# Altium schematic sheet TMC2130.SchDoc
size A
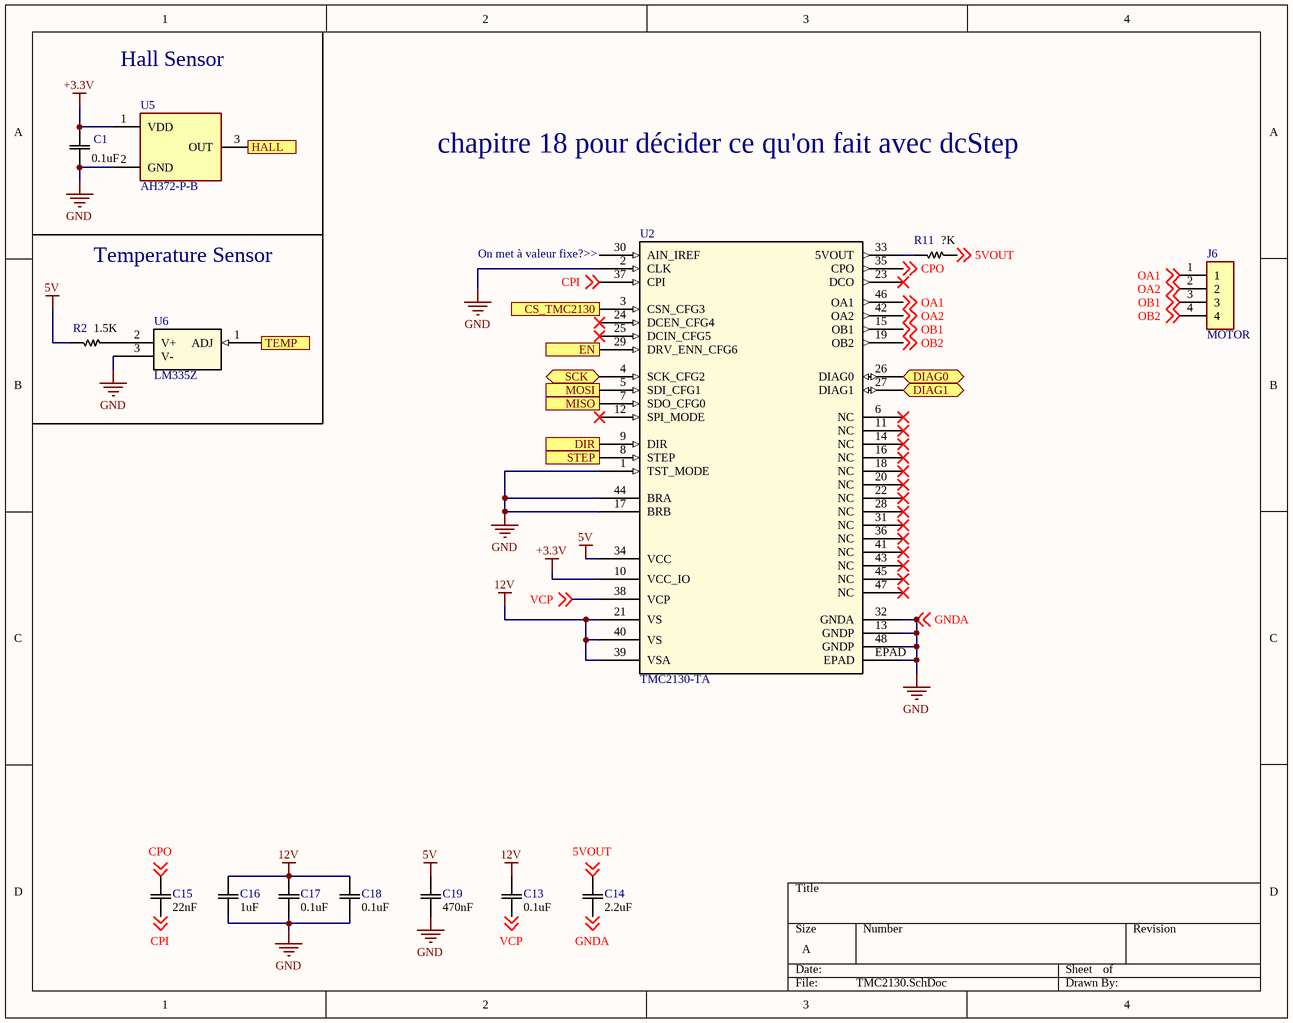
[diagram p0: TMC2130.SchDoc]

## Parts
C1  value 0.1uF  [0603]  (hidden comment: Capacitor 1206)
C13  value 0.1uF  [0603]  (hidden comment: Capacitor 1206)
C14  value 2.2uF  [0603]  (hidden comment: Capacitor 1206)
C15  value 22nF  [0603]  (hidden comment: Capacitor 1206)
C16  value 1uF  [0603]  (hidden comment: Capacitor 1206)
C17  value 0.1uF  [0603]  (hidden comment: Capacitor 1206)
C18  value 0.1uF  [0603]  (hidden comment: Capacitor 1206)
C19  value 470nF  [0603]  (hidden comment: Capacitor 1206)
J6  MOTOR  [JST 4POS 2.5mm 90°]
R2  value 1.5K  [0603]  (hidden comment: Resistor 1206)
R11  value ?K  [0603]  (hidden comment: Resistor 1206)
U2  TMC2130-TA  [eTQFP48_9x9]
U5  AH372-P-B  [AH372PB]
U6  LM335Z  [TO92]

## Ports
CS_TMC2130 (in), DIAG0 (bidir), DIAG1 (bidir), DIR (in), EN (in), HALL (out), MISO (out), MOSI (in), SCK (bidir), STEP (in), TEMP (out)

## Nets
5V: C19.2 R2.1 U2.34(VCC)
12V: C13.2 C16.2 C17.2 C18.2 U2.21(VS) U2.39(VSA) U2.40(VS)
+3.3V: C1.2 U2.10(VCC_IO) U5.1(VDD)
GND: C1.1 C14.1 C16.1 C17.1 C18.1 C19.1 U2.1(TST_MODE) U2.2(CLK) U2.13(GNDP) U2.17(BRB) U2.32(GNDA) U2.44(BRA) U2.48(GNDP) U2.EPAD U5.2(GND) U6.3(V-) ; off-sheet GNDA  [also labelled GNDA]
5VOUT: C14.2 R11.2 ; off-sheet 5VOUT
CPI: C15.1 U2.37(CPI) ; off-sheet CPI
CPO: C15.2 U2.35(CPO) ; off-sheet CPO
CS_TMC2130: U2.3(CSN_CFG3) ; port CS_TMC2130
DIAG0: U2.26(DIAG0) ; port DIAG0
DIAG1: U2.27(DIAG1) ; port DIAG1
DIR: U2.9(DIR) ; port DIR
EN: U2.29(DRV_ENN_CFG6) ; port EN
HALL: U5.3(OUT) ; port HALL
MISO: U2.7(SDO_CFG0) ; port MISO
MOSI: U2.5(SDI_CFG1) ; port MOSI
OA1: J6.1 U2.46(OA1) ; off-sheet OA1
OA2: J6.2 U2.42(OA2) ; off-sheet OA2
OB1: J6.3 U2.15(OB1) ; off-sheet OB1
OB2: J6.4 U2.19(OB2) ; off-sheet OB2
SCK: U2.4(SCK_CFG2) ; port SCK
STEP: U2.8(STEP) ; port STEP
TEMP: U6.1(ADJ) ; port TEMP
VCP: C13.1 U2.38(VCP) ; off-sheet VCP
NetR2_2: R2.2 U6.2(V+)
NetR11_1: R11.1 U2.33(5VOUT)

Not connected (* = marked no-connect by the designer): U2 6(NC)* 11(NC)* 12(SPI_MODE)* 14(NC)* 16(NC)* 18(NC)* 20(NC)* 22(NC)* 23(DCO)* 24(DCEN_CFG4)* 25(DCIN_CFG5)* 28(NC)* 30(AIN_IREF) 31(NC)* 36(NC)* 41(NC)* 43(NC)* 45(NC)* 47(NC)*

## Notes on the sheet
- Hall Sensor
- chapitre 18 pour décider ce qu'on fait avec dcStep
- Temperature Sensor
- (near U2) On met à valeur fixe?>>

## Library data of the parts
C1 C13-C19 = Capacitor 1206: Capacitor SMD 1206; Manufacturer_Part_Number: 12065A820JAT2A; Vendor: AVX Corporation; Built_By: EMA_UL_Team; Type: DEV; Copyright: Copyright (C) 2018 Accelerated Designs. All rights reserved; RefDes: RefDes
J6 = JST 4POS: Connector; Manufacturer_Name: JST (JAPAN SOLDERLESS TERMINALS); Manufacturer_Part_Number: S4B-XH-A(LF)(SN); Datasheet Link: http://www.jst-mfg.com/product/pdf/eng/eXH.pdf; Height: 7mm; RS Part Number: 8201589P; RS Price/Stock: http://uk.rs-online.com/web/p/products/8201589P
R2 R11 = Resistor 1206: Resistor 1206 SMD; Manufacturer_Part_Number: ERJ8CWFR024V; Vendor: Panasonic; Built_By: EMA_Cory; Copyright: Copyright (C) 2018 Accelerated Designs. All rights reserved; RefDes: RefDes; Type: DEV
U2 = TMC2130-TA: Motor Driver TMC2130; Built_By: EMA_Jessica; Vendor: TRINAMIC; Copyright: Copyright (C) 2016 Accelerated Designs. All rights reserved; Manufacturer_Part_Number: TMC2130-TA; RefDes: RefDes; Type: DEV; Value: Value
U5 = AH372-P-B: Hall Sensor; Manufacturer_Name: Diodes Inc.; Datasheet Link: https://www.mouser.com/datasheet/2/115/AH372-1317530.pdf; Height: 4.75mm; Manufacturer_Part_Number: AH372-P-B; Mouser Part Number: 621-AH372-P-B; Mouser Price/Stock: https://www.mouser.com/Search/Refine.aspx?Keyword=621-AH372-P-B; RS Part Number: 1333361P; RS Price/Stock: http://uk.rs-online.com/web/p/products/1333361P
U6 = LM335Z: Temperature Sensor; VENDOR: STMicroelectronics; Built_By: EMA_UL_Team; MANUFACTURER_PART_NUMBER: LM335Z; Copyright: Copyright (C) 2018 Accelerated Designs. All rights reserved; RefDes: RefDes; Type: DEV; Value: Value